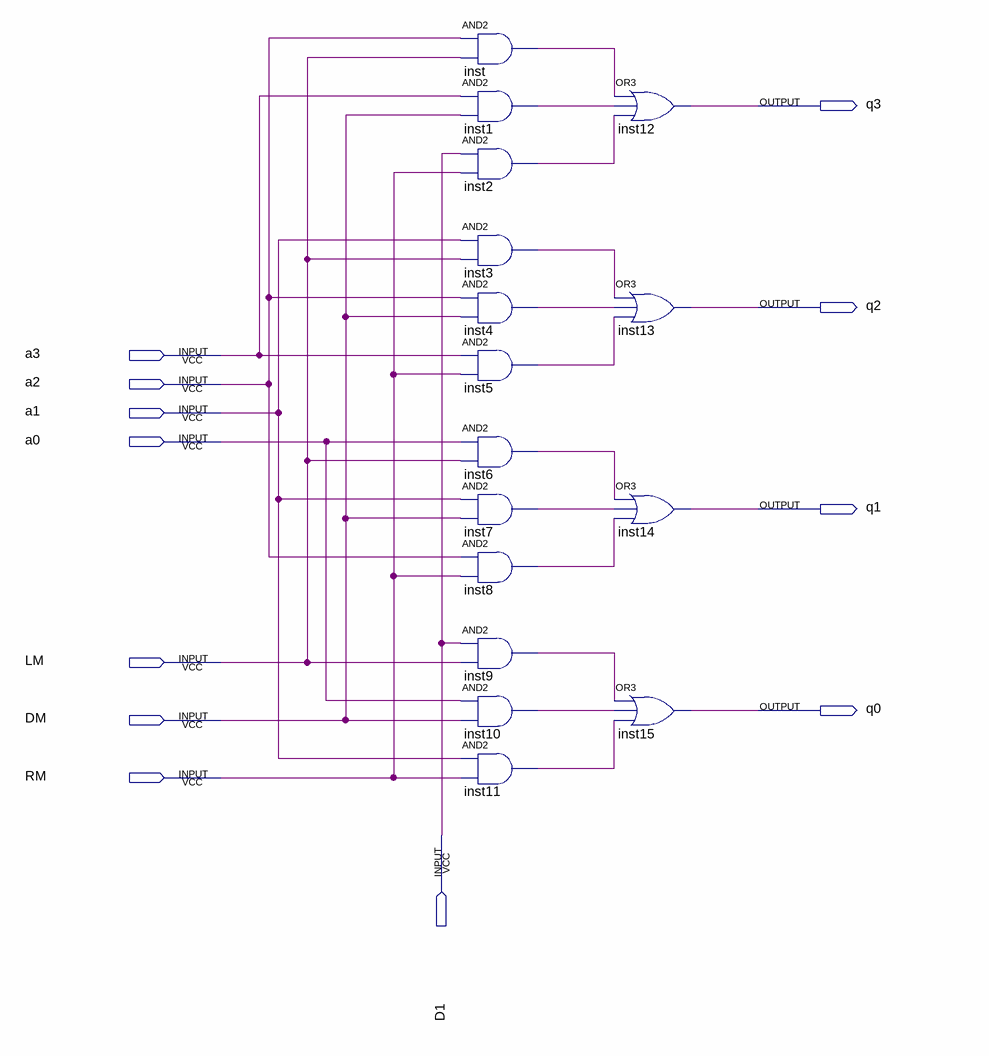
[diagram p0: schematic sheet]
// Quartus schematic shifter.bdf as structural Verilog: 16 symbols, 12 pins
module shifter (
  input  a3,
  input  a2,
  input  a1,
  input  a0,
  input  LM,
  input  DM,
  input  RM,
  input  D1,
  output q3,
  output q2,
  output q1,
  output q0
);

  wire inst1_out, inst2_out, inst3_out, inst4_out, inst5_out, inst6_out, inst7_out, inst8_out, inst9_out,
       inst10_out, inst11_out, inst_out;

  and inst (inst_out, a2, LM);
  and inst1 (inst1_out, a3, DM);
  and inst2 (inst2_out, D1, RM);
  and inst3 (inst3_out, a1, LM);
  and inst4 (inst4_out, a2, DM);
  and inst5 (inst5_out, a3, RM);
  and inst6 (inst6_out, a0, LM);
  and inst7 (inst7_out, a1, DM);
  and inst8 (inst8_out, a2, RM);
  and inst9 (inst9_out, D1, LM);
  and inst10 (inst10_out, a0, DM);
  and inst11 (inst11_out, a1, RM);
  or inst12 (q3, inst_out, inst1_out, inst2_out);
  or inst13 (q2, inst3_out, inst4_out, inst5_out);
  or inst14 (q1, inst6_out, inst7_out, inst8_out);
  or inst15 (q0, inst9_out, inst10_out, inst11_out);
endmodule
